# EAGLE schematic ethernet_usb (EAGLE 8.1.0)
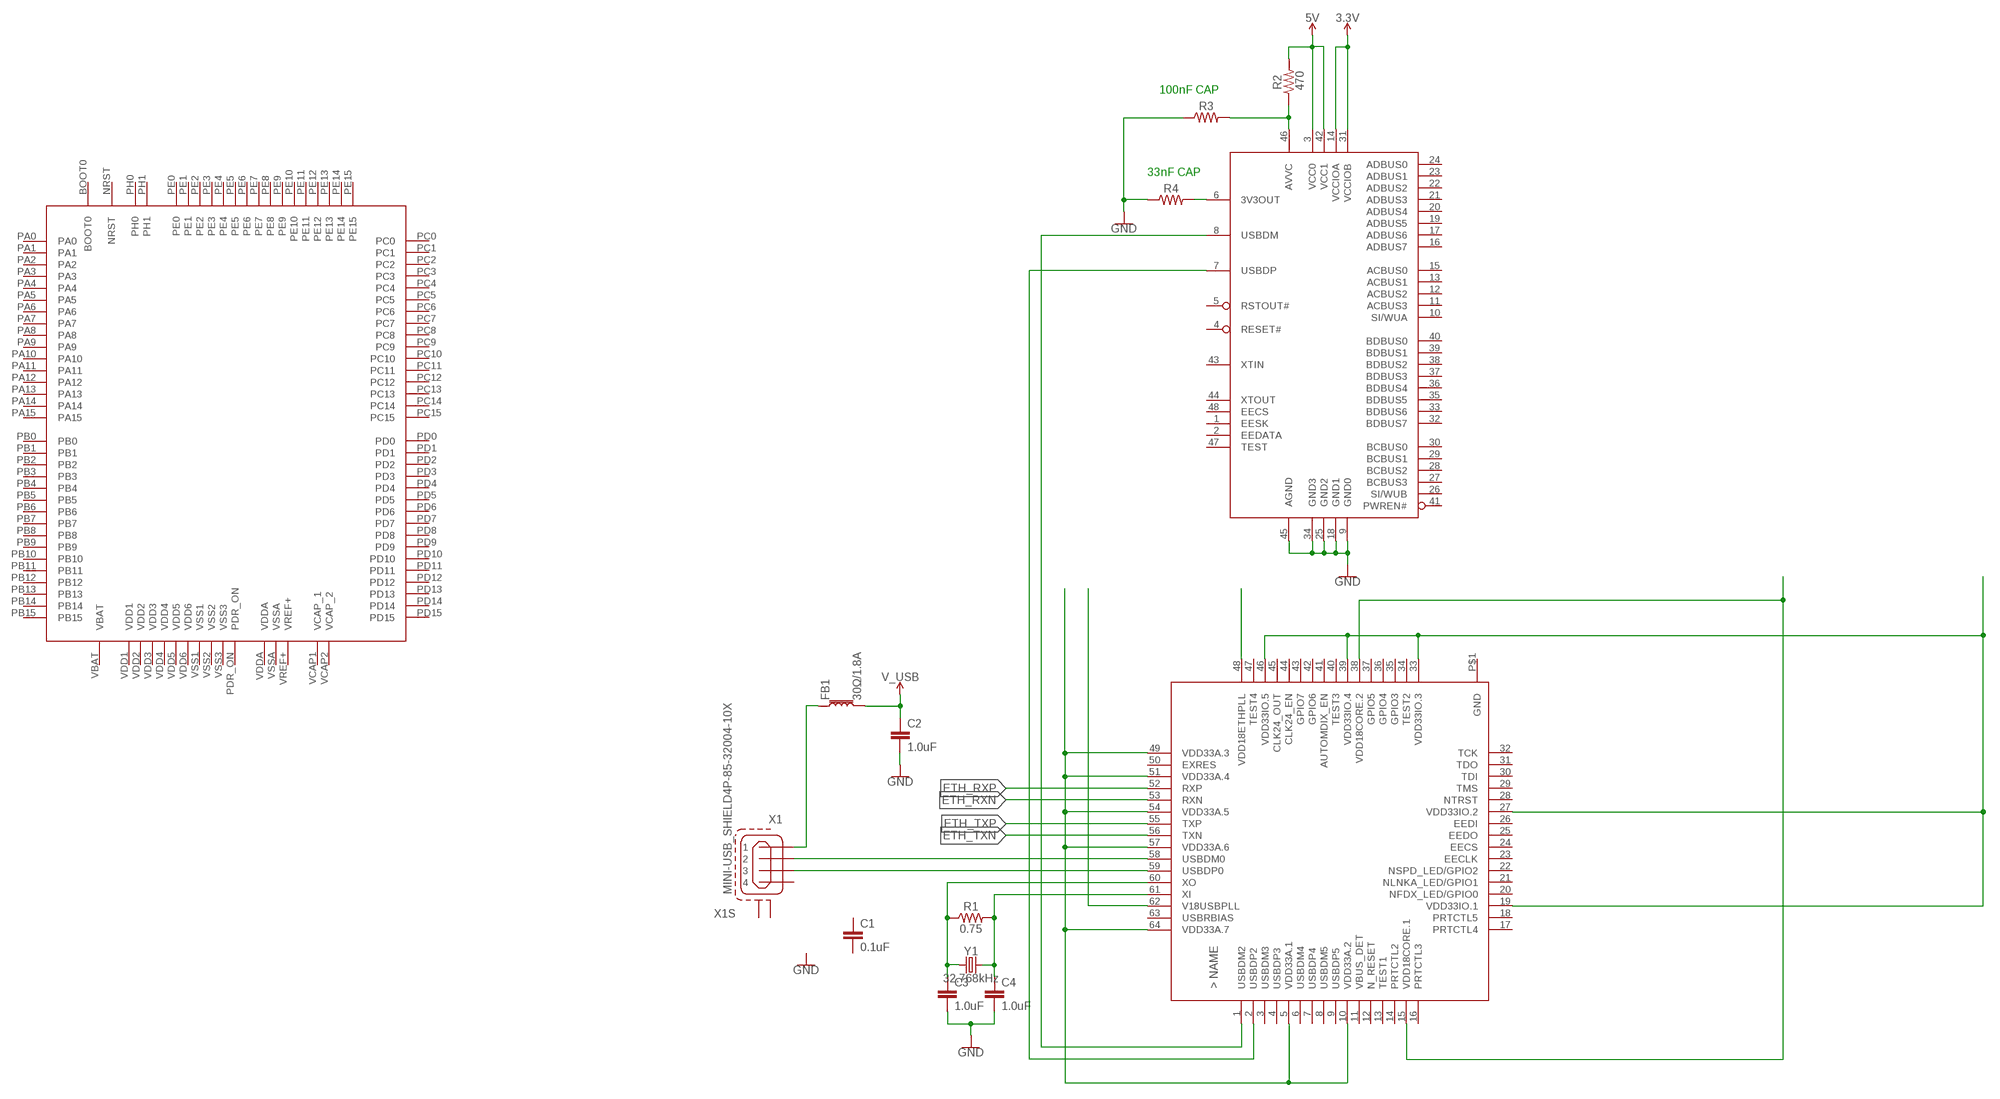
[diagram p0: schematic, sheet 1]

## Parts
C1  0.1uF  0.1UF-0603-25V-(+80/-20%)  [0603]
C2  1.0uF  1.0UF-1206-50V-10%  [1206]
C3  1.0uF  1.0UF-0805-25V-10%  [0805]
C4  1.0uF  1.0UF-0805-25V-10%  [0805]
FB1  30Ω/1.8A  FERRITE_BEAD-0603  [0603]
R1  0.75  0.75OHM-0805-1/4W-1%  [0805]
R2  470  RESISTOR0805  [0805]
R3  RESISTOR0805  [0805]
R4  RESISTOR0805  [0805]
U1  FT2232L  [LQFP48]
U$1  STM32F4V_100PIN_GENERIC  [LQFP100]
U$2  LAN9514  [QFN-64]
X1  MINI-USB_SHIELD4P-85-32004-10X  [85-32004-10X]
Y1  32.768kHz  CRYSTAL-32.768KHZPTH-2X6  [CRYSTAL-PTH-2X6-CYL]

## Nets
3.3V: U1.14(VCCIOA) U1.31(VCCIOB)
5V: R2.2 U1.3(VCC0) U1.42(VCC1)
ETH_RXN: U$2.53(RXN)
ETH_RXP: U$2.52(RXP)
ETH_TXN: U$2.56(TXN)
ETH_TXP: U$2.55(TXP)
GND: C2.2 C3.2 C4.2 R3.1 R4.1 U1.9(GND0) U1.18(GND1) U1.25(GND2) U1.34(GND3) U1.45(AGND)
N$1: U1.8(USBDM) U$2.1(USBDM2)
N$2: U1.7(USBDP) U$2.2(USBDP2)
N$3: FB1.1 X1.1
N$4: U$2.15(VDD18CORE.1) U$2.38(VDD18CORE.2)
N$5: U$2.48(VDD18ETHPLL)
N$6: U$2.5(VDD33A.1) U$2.10(VDD33A.2) U$2.49(VDD33A.3) U$2.51(VDD33A.4) U$2.54(VDD33A.5) U$2.57(VDD33A.6) U$2.64(VDD33A.7)
N$7: U$2.62(V18USBPLL)
N$8: U$2.19(VDD33IO.1) U$2.27(VDD33IO.2) U$2.33(VDD33IO.3) U$2.39(VDD33IO.4) U$2.46(VDD33IO.5)
N$9: C4.1 R1.2 U$2.61(XI) Y1.2
N$10: C3.1 R1.1 U$2.60(XO) Y1.1
N$12: R2.1 R3.2 U1.46(AVVC)
N$16: R4.2 U1.6(3V3OUT)
USBDMHOST: U$2.58(USBDM0) X1.2
USBDPHOST: U$2.59(USBDP0) X1.3
V_USB: C2.1 FB1.2
Unconnected: C1.1 C1.2 U1.1(EESK) U1.2(EEDATA) U1.4(RESET#) U1.5(RSTOUT#) U1.10(SI/WUA) U1.11(ACBUS3) U1.12(ACBUS2) U1.13(ACBUS1) U1.15(ACBUS0) U1.16(ADBUS7) U1.17(ADBUS6) U1.19(ADBUS5) U1.20(ADBUS4) U1.21(ADBUS3) U1.22(ADBUS2) U1.23(ADBUS1) U1.24(ADBUS0) U1.26(SI/WUB) U1.27(BCBUS3) U1.28(BCBUS2) U1.29(BCBUS1) U1.30(BCBUS0) U1.32(BDBUS7) U1.33(BDBUS6) U1.35(BDBUS5) U1.36(BDBUS4) U1.37(BDBUS3) U1.38(BDBUS2) U1.39(BDBUS1) U1.40(BDBUS0) U1.41(PWREN#) U1.43(XTIN) U1.44(XTOUT) U1.47(TEST) U1.48(EECS) U$1.BOOT0 U$1.NRST U$1.PA0 U$1.PA1 U$1.PA2 U$1.PA3 U$1.PA4 U$1.PA5 U$1.PA6 U$1.PA7 U$1.PA8 U$1.PA9 U$1.PA10 U$1.PA11 U$1.PA12 U$1.PA13 U$1.PA14 U$1.PA15 U$1.PB0 U$1.PB1 U$1.PB2 U$1.PB3 U$1.PB4 U$1.PB5 U$1.PB6 U$1.PB7 U$1.PB8 U$1.PB9 U$1.PB10 U$1.PB11 U$1.PB12 U$1.PB13 U$1.PB14 U$1.PB15 U$1.PC0 U$1.PC1 U$1.PC2 U$1.PC3 U$1.PC4 U$1.PC5 U$1.PC6 U$1.PC7 U$1.PC8 U$1.PC9 U$1.PC10 U$1.PC11 U$1.PC12 U$1.PC13 U$1.PC14 U$1.PC15 U$1.PD0 U$1.PD1 U$1.PD2 U$1.PD3 U$1.PD4 U$1.PD5 U$1.PD6 U$1.PD7 U$1.PD8 U$1.PD9 U$1.PD10 U$1.PD11 U$1.PD12 U$1.PD13 U$1.PD14 U$1.PD15 U$1.PDR_ON U$1.PE0 U$1.PE1 U$1.PE2 U$1.PE3 U$1.PE4 U$1.PE5 U$1.PE6 U$1.PE7 U$1.PE8 U$1.PE9 U$1.PE10 U$1.PE11 U$1.PE12 U$1.PE13 U$1.PE14 U$1.PE15 U$1.PH0 U$1.PH1 U$1.VBAT U$1.VCAP1(VCAP_1) U$1.VCAP2(VCAP_2) U$1.VDD1 U$1.VDD2 U$1.VDD3 U$1.VDD4 U$1.VDD5 U$1.VDD6 U$1.VDDA U$1.VREF+ U$1.VSS1 U$1.VSS2 U$1.VSS3 U$1.VSSA U$2.3(USBDM3) U$2.4(USBDP3) U$2.6(USBDM4) U$2.7(USBDP4) U$2.8(USBDM5) U$2.9(USBDP5) U$2.11(VBUS_DET) U$2.12(N_RESET) U$2.13(TEST1) U$2.14(PRTCTL2) U$2.16(PRTCTL3) U$2.17(PRTCTL4) U$2.18(PRTCTL5) U$2.20(NFDX_LED/GPIO0) U$2.21(NLNKA_LED/GPIO1) U$2.22(NSPD_LED/GPIO2) U$2.23(EECLK) U$2.24(EECS) U$2.25(EEDO) U$2.26(EEDI) U$2.28(NTRST) U$2.29(TMS) U$2.30(TDI) U$2.31(TDO) U$2.32(TCK) U$2.34(TEST2) U$2.35(GPIO3) U$2.36(GPIO4) U$2.37(GPIO5) U$2.40(TEST3) U$2.41(AUTOMDIX_EN) U$2.42(GPIO6) U$2.43(GPIO7) U$2.44(CLK24_EN) U$2.45(CLK24_OUT) U$2.47(TEST4) U$2.50(EXRES) U$2.63(USBRBIAS) U$2.P$1(GND) X1.4 X1.M1(S1) X1.M2(S2)

## Notes on the sheet
- 100nF CAP
- 33nF CAP

## Library data of the parts
C1 = SparkFun-Capacitors:0.1UF: 0.1µF ceramic capacitors A capacitor is a passive two-terminal electrical component used to store electrical energy temporarily in an electric field.; PROD_ID: CAP-00810
C2 = SparkFun-Capacitors:1.0UF: 1µF ceramic capacitors A capacitor is a passive two-terminal electrical component used to store electrical energy temporarily in an electric field.; PROD_ID: CAP-09822
C3 C4 = SparkFun-Capacitors:1.0UF: 1µF ceramic capacitors A capacitor is a passive two-terminal electrical component used to store electrical energy temporarily in an electric field.; PROD_ID: CAP-08064
FB1 = SparkFun-Coils:FERRITE_BEAD: Ferrite Bead (blocks, cores, rings, chokes, etc.) Inductor with layers of ferrite used to suppress high frequencies. Often used to isolate high frequency noise. SparkFun Products: IOIO-OTG - V2.2 <https://www.sparkfun.com/products/13613> SparkFun SAMD21 Mini Breakout <https://www.sparkfun.com/products/13664> SparkFun 6 Degrees of Freedom Breakout - LSM6DS3 <https://www.sparkfun.com/products/13339> SparkFun SAMD21 Dev Breakout <https://www.sparkfun.com/products/13672>; PROD_ID: NDUC-07859
R1 = SparkFun-Resistors:0.75OHM: 0.75Ω resistor A resistor is a passive two-terminal electrical component that implements electrical resistance as a circuit element. Resistors act to reduce current flow, and, at the same time, act to lower voltage levels within circuits. - Wikipedia; PROD_ID: RES-08474
R2-R4 = SparkFun-Resistors:RESISTOR: Generic Resistor Package
U1 = ftdichip-6:FT2232L: USB UART / FIFO Controller 3nd Generation USB Double-UART (USB <-> Serial) - FIFO Controller
U$1 = stm32f4:STM32F4V_100PIN_GENERIC
U$2 = Eagle-Library:LAN9514
X1 = con-cypressindustries:MINI-USB_SHIELD4P-: MINI USB 4 Pol. Source: www.cypressindustries.com; OC_FARNELL: unknown; OC_NEWARK: unknown
Y1 = SparkFun-Clocks:CRYSTAL-32.768KHZ: 32.768kHz Crystal Frequency: 32.768kHz Frequency Stability: ±20ppm Load Capacitance: 12.5pF (PTH-2X6 & SMD-3.2X1.5), 6pF (SMD-2X6) SparkFun Products: SparkFun BigTime Watch Kit <https://www.sparkfun.com/products/11734> SparkFun nRF52832 Breakout <https://www.sparkfun.com/products/13990> SparkFun Real Time Clock Module <https://www.sparkfun.com/products/12708>; PROD_ID: XTAL-10112